# Altium schematic sheet UART.SchDoc
size A4
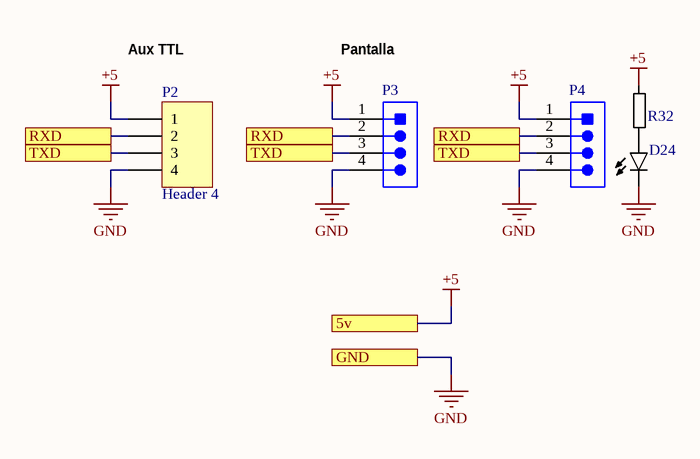
[diagram p0: UART.SchDoc]

## Parts
D24  597-3305-607F  [0805 LED]  (value not drawn)
P2  Header 4  [HDR1X4]
P3  B4B-PH-K-S(LF)(SN)  [JST-B4B-PH-K-S_V]  (value not drawn)
P4  B4B-PH-K-S(LF)(SN)  [JST-B4B-PH-K-S_V]  (value not drawn)
R32  CR0805-JW-221ELF  [0805 res]  (value not drawn)

## Ports
5v, GND, RXD, TXD

## Nets
+5: P2.1 P3.1 P4.1 R32.1 ; port 5v
GND: D24.C P2.4 P3.4 P4.4 ; port GND
RXD: P2.2 P3.2 P4.2 ; port RXD
TXD: P2.3 P3.3 P4.3 ; port TXD
NetD24_A: D24.A R32.2

## Notes on the sheet
- (near P2) Aux TTL
- (near P3) Pantalla

## Library data of the parts
D24 = 597-3305-607F: LED Uni-Color Green 4-Pin Chip 0805 T/R; Availability: Unavailable; Value: *; Price: None; MP: 597-3305-607F; Package: None
P2 = Header 4: Header, 4-Pin; LatestRevisionDate: 17-Jul-2002; LatestRevisionNote: Re-released for DXP Platform.; Publisher: Altium Limited
P3 P4 = CMP-2000-05165-1: Male Header, Pitch 2 mm, 1 x 4 Position, Height 6 mm, Tail Length 3.4 mm, -25 to 85 degC, RoHS, Bulk; Manufacturer: JST; No of Positions: 4; Style/Orientation: StraightHeader/Plug; Pitch: 2mm; Datasheet URL: http://datasheet.octopart.com/B4B-PH-K-S%28LF%29%28SN%29-JST-datasheet-10558886.pdf; Type: ShroudedHeader; Manufacturer URL: http://www.jst.com/home2.html; Termination: Crimp; Datasheet Version: Apr-09
R32 = CR0805-JW-221ELF: 220 Ohms Â±5% 0.125W, 1/8W Chip Resistor 0805 (2012 Metric) Moisture Resistant Thick Film; MF: Bourns; Value: *; Check_prices: https://www.snapeda.com/parts/CR0805-JW-221ELF/Bourns/view-part/?ref=eda; MP: CR0805-JW-221ELF; Price: None; Package: 2012 Bourns; Availability: In Stock; SnapEDA_Link: https://www.snapeda.com/parts/CR0805-JW-221ELF/Bourns/view-part/?ref=snap; Purchase-URL: https://pricing.snapeda.com/search/part/CR0805-JW-221ELF/?ref=eda